# EAGLE schematic BEPdisp1 (EAGLE 6.4)
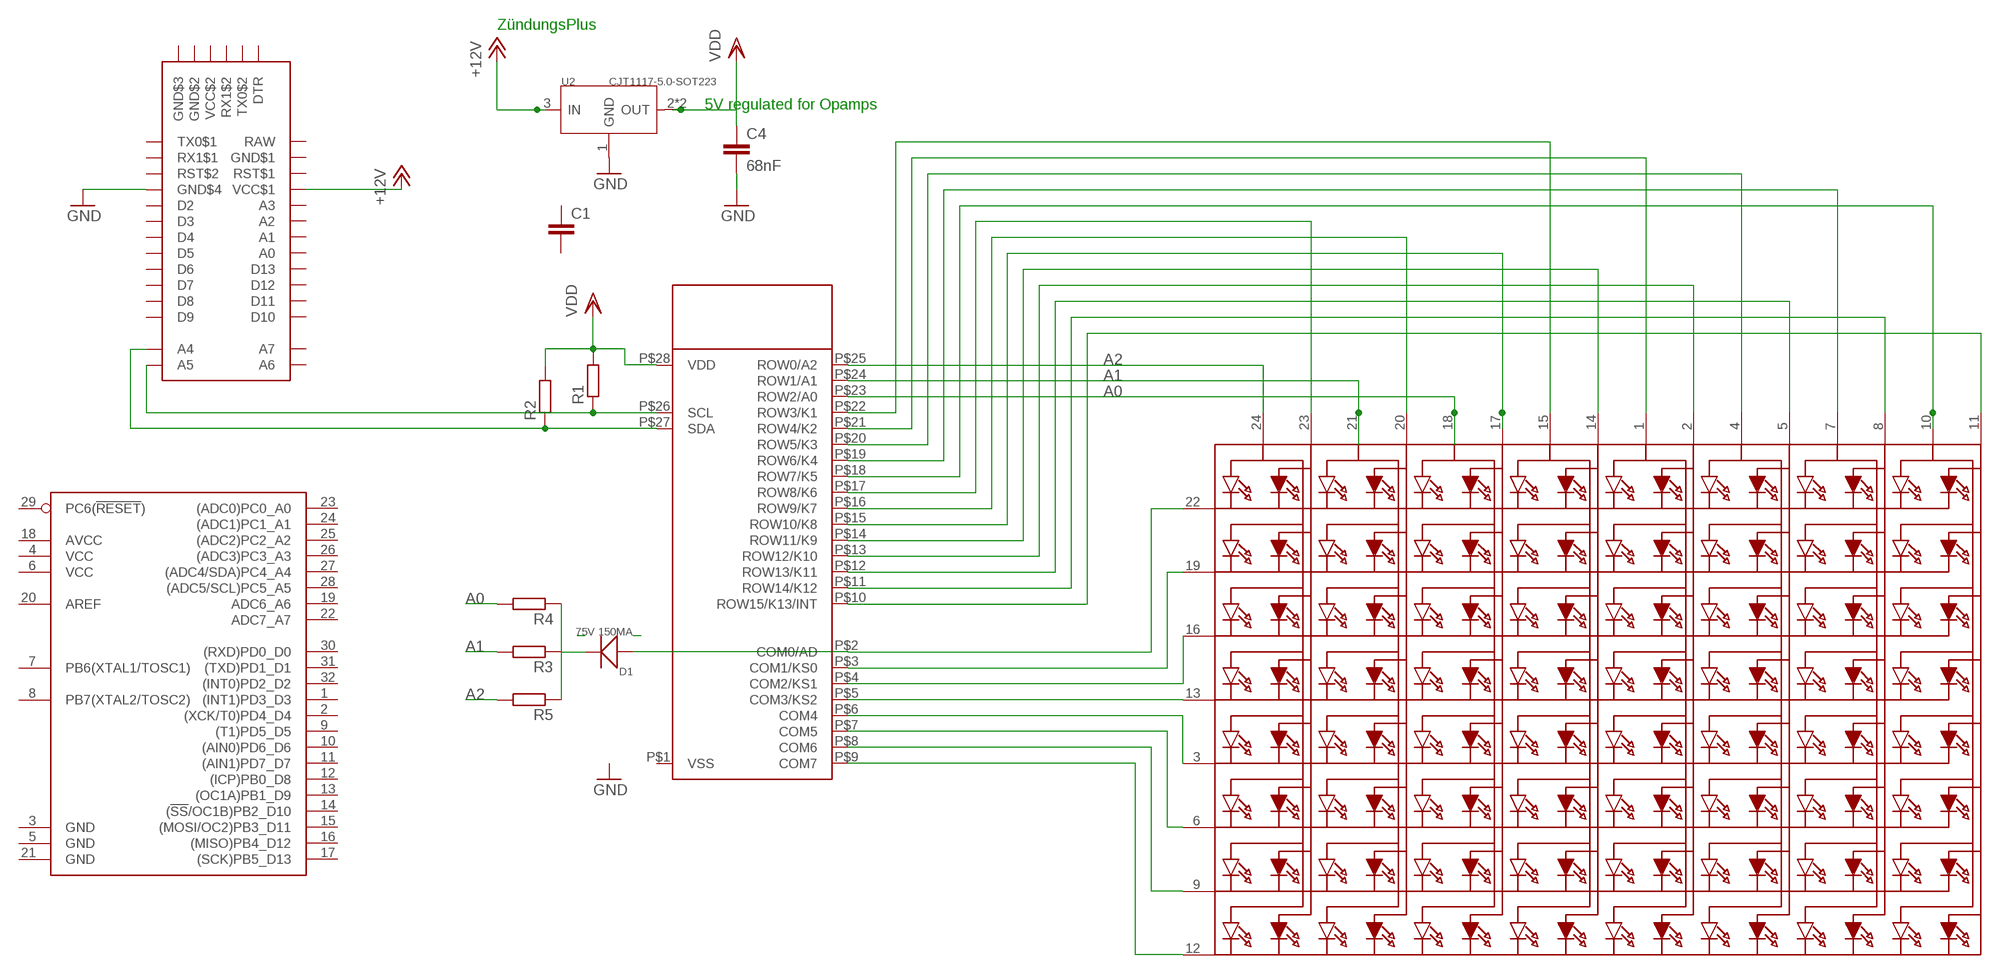
[diagram p0: schematic, sheet 1]

## Parts
C1  C-EUC0805  [C0805]
C4  68nF  C-EUC1206K  [C1206K]
D1  75V 150MA  SMD-DIODE-SWITCHING-75V-150MA(D1206)  [LED-1206]
IC1  ATMEGA48A-ARDUINO-TQFP  [TQFP32-08]
LED1  SEGMENT_8X8_BICOLOR_ROWCATHODEMI2A883XX  [SEGMENT_BICOL_BL-M12A883XX]
R1  R-EU_R0805  [R0805]
R2  R-EU_R0805  [R0805]
R3  R-EU_R0805  [R0805]
R4  R-EU_R0805  [R0805]
R5  R-EU_R0805  [R0805]
U1  HT16K33-SOP28  [SOP-28]
U2  CJT1117-5.0-SOT223  PMIC-CJT1117-5.0(SOT223)  [SOT-223]
U$1  ARDUINO_PRO_MINI  [ARDUINO_PRO_MINI]

## Nets
+12V: U2.3(IN) U$1.VCC$1
A0: LED1.18(A5) R4.2 U1.P$23(ROW2/A0)
A1: LED1.21(A3) R3.2 U1.P$24(ROW1/A1)
A2: LED1.24(A1) R5.2 U1.P$25(ROW0/A2)
GND: C4.2 U2.1(GND) U$1.GND$4
N$1: R1.1 U1.P$26(SCL) U$1.A5
N$2: R2.1 U1.P$27(SDA) U$1.A4
N$4: LED1.16(K3) U1.P$4(COM2/KS1)
N$5: LED1.13(K4) U1.P$5(COM3/KS2)
N$6: LED1.3(K5) U1.P$6(COM4)
N$7: LED1.6(K6) U1.P$7(COM5)
N$8: LED1.9(K7) U1.P$8(COM6)
N$9: LED1.12(K8) U1.P$9(COM7)
N$10: LED1.19(K2) U1.P$3(COM1/KS0)
N$11: LED1.22(K1) U1.P$2(COM0/AD)
N$12: LED1.15(A7) U1.P$22(ROW3/K1)
N$13: LED1.1(A9) U1.P$21(ROW4/K2)
N$14: LED1.4(A11) U1.P$20(ROW5/K3)
N$15: LED1.7(A13) U1.P$19(ROW6/K4)
N$16: LED1.10(A15) U1.P$18(ROW7/K5)
N$17: LED1.23(A2) U1.P$17(ROW8/K6)
N$18: LED1.20(A4) U1.P$16(ROW9/K7)
N$19: LED1.17(A6) U1.P$15(ROW10/K8)
N$20: LED1.14(A8) U1.P$14(ROW11/K9)
N$21: LED1.2(A10) U1.P$13(ROW12/K10)
N$22: LED1.5(A12) U1.P$12(ROW13/K11)
N$23: LED1.8(A14) U1.P$11(ROW14/K12)
N$24: LED1.11(A16) U1.P$10(ROW15/K13/INT)
N$25: D1.+
N$27: D1.-
N$29: R4.1 R5.1
VDD: C4.1 R1.2 R2.2 U1.P$28(VDD) U2.2(OUT) U2.TER(OUT)
Unconnected: C1.1 C1.2 IC1.1((INT1)PD3_D3) IC1.2((XCK/T0)PD4_D4) IC1.7(PB6(XTAL1/TOSC1)) IC1.8(PB7(XTAL2/TOSC2)) IC1.9((T1)PD5_D5) IC1.10((AIN0)PD6_D6) IC1.11((AIN1)PD7_D7) IC1.12((ICP)PB0_D8) IC1.13((OC1A)PB1_D9) IC1.14((!SS!/OC1B)PB2_D10) IC1.15((MOSI/OC2)PB3_D11) IC1.16((MISO)PB4_D12) IC1.17((SCK)PB5_D13) IC1.19(ADC6_A6) IC1.20(AREF) IC1.22(ADC7_A7) IC1.23((ADC0)PC0_A0) IC1.24((ADC1)PC1_A1) IC1.25((ADC2)PC2_A2) IC1.26((ADC3)PC3_A3) IC1.27((ADC4/SDA)PC4_A4) IC1.28((ADC5/SCL)PC5_A5) IC1.29(PC6(!RESET!)) IC1.30((RXD)PD0_D0) IC1.31((TXD)PD1_D1) IC1.32((INT0)PD2_D2) R3.1 U1.P$1(VSS) U$1.A0 U$1.A1 U$1.A2 U$1.A3 U$1.A6 U$1.A7 U$1.D2 U$1.D3 U$1.D4 U$1.D5 U$1.D6 U$1.D7 U$1.D8 U$1.D9 U$1.D10 U$1.D11 U$1.D12 U$1.D13 U$1.DTR U$1.RST$1 U$1.RST$2 U$1.RX1$1 U$1.RX1$2 U$1.TX0$1 U$1.TX0$2

## Notes on the sheet
- ZündungsPlus
- 5V regulated for Opamps

## Power pins joined to a net without a drawn wire
AVCC: IC1.18(AVCC)
GND: IC1.3(GND) IC1.5(GND) IC1.21(GND)
GND$1: U$1.GDN$1(GND$1)
GND$2: U$1.GND$2
GND$3: U$1.GND$3
RAW: U$1.RAW
VCC: IC1.4(VCC) IC1.6(VCC)
VCC$2: U$1.VCC$2

## Library data of the parts
C1 C4 = rcl:C-EU: CAPACITOR, European symbol
D1 = Seeed-Diode-2016:SMD-DIODE-SWITCHING-75V-150MA(D1206): 304040005; MPN: CD1206-S01575
IC1 = ATMEGA_-ARDUINO-TQFP:ATMEGA*-ARDUINO-TQFP
LED1 = SEGMENT_8X8_BICOLOR_ROWCATHODE:SEGMENT_8X8_BICOLOR_ROWCATHODE
R1-R5 = rcl:R-EU_: RESISTOR, European symbol
U1 = HT16K33-SOP28:HT16K33-SOP28
U2 = Seeed-IC-2016:PMIC-CJT1117-5.0(SOT223): 310030096; MPN: CJT1117-5.0
U$1 = ARDUINO_PRO_MINI:ARDUINO_PRO_MINI